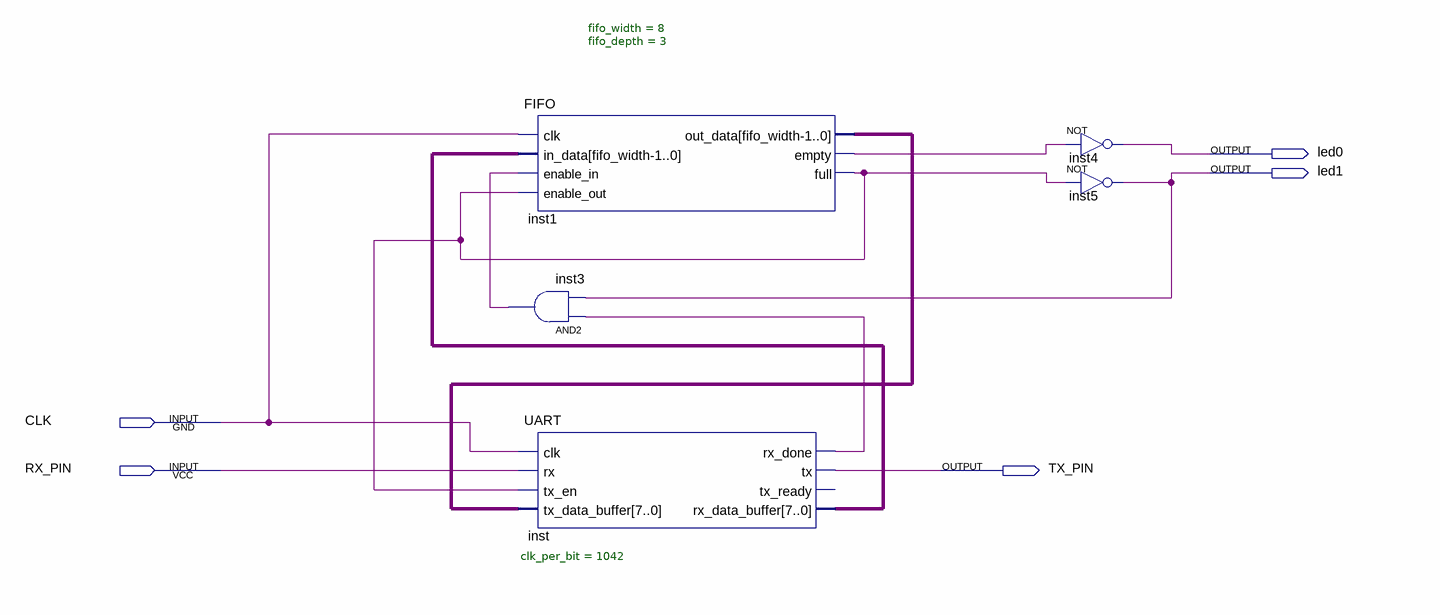
[diagram p0: schematic sheet]
// Quartus schematic fifo-uart.bdf as structural Verilog: 5 symbols, 5 pins
module \fifo-uart  (
  input  CLK,
  input  RX_PIN,
  output led0,
  output led1,
  output TX_PIN
);

  wire inst1_empty, inst1_full, inst3_out, inst_rx_done;
  wire [7:0] inst1_out_data, inst_rx_data_buffer;

  FIFO #(.fifo_width(8), .fifo_depth(3)) inst1 (
    .clk(CLK), .in_data(inst_rx_data_buffer), .enable_in(inst3_out), .enable_out(inst1_full),
    .out_data(inst1_out_data), .empty(inst1_empty), .full(inst1_full));
  and inst3 (inst3_out, inst_rx_done, led1);
  UART #(.clk_per_bit(1042)) inst (
    .clk(CLK), .rx(RX_PIN), .tx_en(inst1_full), .tx_data_buffer(inst1_out_data), .rx_done(inst_rx_done),
    .tx(TX_PIN), .rx_data_buffer(inst_rx_data_buffer));  // open: tx_ready
  not inst4 (led0, inst1_empty);
  not inst5 (led1, inst1_full);
endmodule
